# Altium schematic sheet PAGE2 - MCU.SchDoc: Koruza move driver
size A4; DrawnBy: Matej Gomboc; DocumentNumber: 2; Revision: 1.0; SheetNumber: 2; SheetTotal: 4
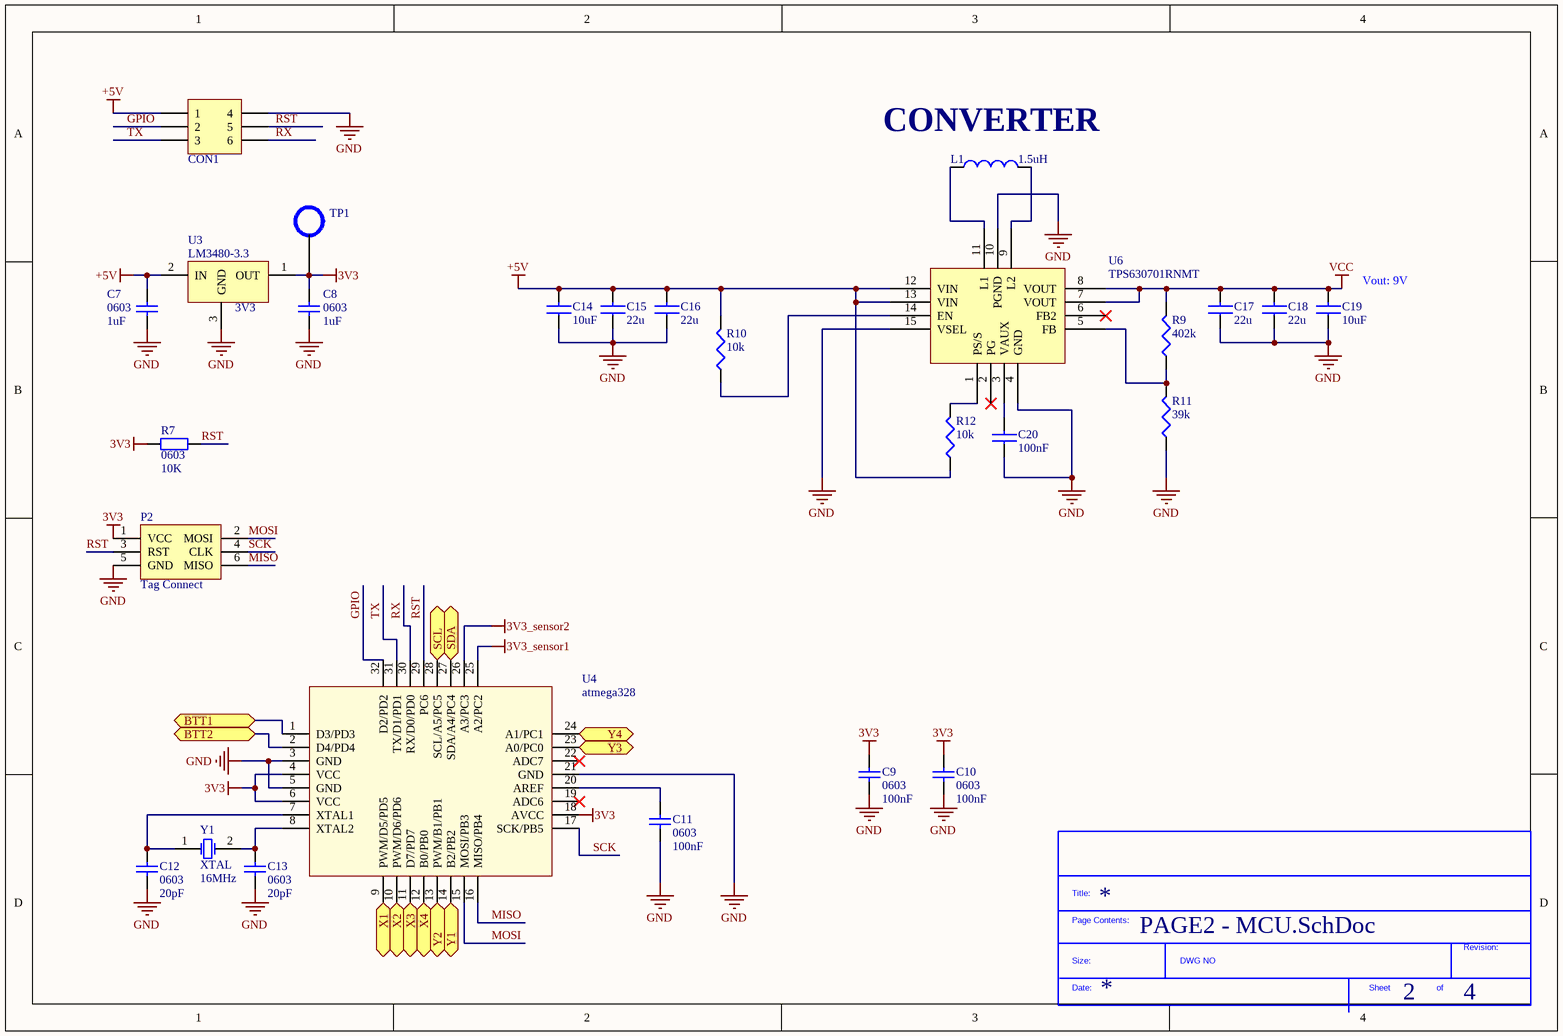
[diagram p0: PAGE2 - MCU.SchDoc]

## Parts
*?  SDTitleBlock  (value not drawn)  (graphical)
C7  0603  value 1uF  [0603_HandSoldering]
C8  0603  value 1uF  [0603_HandSoldering]
C9  0603  value 100nF  [0603_HandSoldering]
C10  0603  value 100nF  [0603_HandSoldering]
C11  0603  value 100nF  [0603_HandSoldering]
C12  0603  value 20pF  [0603_HandSoldering]
C13  0603  value 20pF  [0603_HandSoldering]
C14  10uF  [CAP0805]
C15  22u  [CAP0805]
C16  22u  [CAP0805]
C17  22u  [CAP0805]
C18  22u  [CAP0805]
C19  10uF  [CAP0805]
C20  100nF  [CAP0603]
CON1  MICROMATCH 6 SMD  [MICROMATCH2X3]  (value not drawn)
L1  1.5uH  [FDSD0402]
P2  Tag Connect  [Tag Connect]
R7  0603  value 10K  [0603_HandSoldering]
R9  402k  [RES0603]
R10  10k  [RES0603]
R11  39k  [RES0603]
R12  10k  [RES0603]
TP1  TEST_POINT  [TEST_POINT]  (value not drawn)  (no BOM)
U3  LM3480-3.3  value 3V3  [LM3480_SOT23-3]
U4  atmega328  [ATMEGA328_TQFP32]
U6  TPS630701RNMT  [VQFN TPS]
Y1  XTAL  value 16MHz  [XTAL_small]

## Ports
BTT1, BTT2, SCL, SDA, X1, X2, X3, X4, Y1, Y2, Y3, Y4

## Nets
3V3: C8.2 C9.2 C10.2 P2.1(VCC) R7.1 TP1.1(TP) U3.1(OUT) U4.4(VCC) U4.6(VCC) U4.18(AVCC)
3V3_sensor1: U4.25(A2/PC2)
3V3_sensor2: U4.26(A3/PC3)
+5V: C7.2 C14.2 C15.2 C16.2 CON1.1 R10.2 R12.1 U3.2(IN) U6.12(VIN) U6.13(VIN)
GND: C7.1 C8.1 C9.1 C10.1 C11.1 C12.1 C13.1 C14.1 C15.1 C16.1 C17.1 C18.1 C19.1 C20.1 CON1.4 P2.5(GND) R11.1 U3.3(GND) U4.3(GND) U4.5(GND) U4.21(GND) U6.4(GND) U6.10(PGND) U6.15(VSEL)
VCC: C17.2 C18.2 C19.2 R9.2 U6.7(VOUT) U6.8(VOUT)
BTT1: U4.1(D3/PD3) ; port BTT1
BTT2: U4.2(D4/PD4) ; port BTT2
GPIO: CON1.2 U4.32(D2/PD2)
MISO: P2.6(MISO) U4.16(MISO/PB4)
MOSI: P2.2(MOSI) U4.15(MOSI/PB3)
RST: CON1.5 P2.3(RST) R7.2 U4.29(PC6)
RX: CON1.6 U4.30(RX/D0/PD0)
SCK: P2.4(CLK) U4.17(SCK/PB5)
SCL: U4.28(SCL/A5/PC5) ; port SCL
SDA: U4.27(SDA/A4/PC4) ; port SDA
TX: CON1.3 U4.31(TX/D1/PD1)
X1: U4.9(PWM/D5/PD5) ; port X1
X2: U4.10(PWM/D6/PD6) ; port X2
X3: U4.11(D7/PD7) ; port X3
X4: U4.12(B0/PB0) ; port X4
Y1: U4.14(B2/PB2) ; port Y1
Y2: U4.13(PWM/B1/PB1) ; port Y2
Y3: U4.23(A0/PC0) ; port Y3
Y4: U4.24(A1/PC1) ; port Y4
NetC11_2: C11.2 U4.20(AREF)
NetC12_2: C12.2 U4.7(XTAL1) Y1.1(OSC1)
NetC13_2: C13.2 U4.8(XTAL2) Y1.2(OSC2)
NetC20_2: C20.2 U6.3(VAUX)
NetL1_1: L1.1 U6.11(L1)
NetL1_2: L1.2 U6.9(L2)
NetR9_1: R9.1 R11.2 U6.5(FB)
NetR10_1: R10.1 U6.14(EN)
NetR12_2: R12.2 U6.1(PS/S)

Not connected (* = marked no-connect by the designer): U4 19(ADC6)* 22(ADC7)*; U6 2(PG)* 6(FB2)*

## Notes on the sheet
- (near L1) CONVERTER
- (near C19) Vout: 9V
- (in symbol SDTitleBlock) Title:; Page Contents:; Revision:; Size:; DWG NO; Date:; Sheet; of

## Library data of the parts
C7-C13 = capacitor_ceramic: Ceramic Capacitor
C14 C19 = 10uF /16V: TDK - CGA4J1X5R1C106K125AC - CAP, MLCC, X5R, 10UF, 16V, 0805; Supplier 1: Farnell; Manufacturer: TDK; Manufacturer Part Number: CGA4J1X5R1C106K125AC; RoHS: YES; Stock 1: 8974; Pricing 1: 5=0.41, 50=0.146, 250=0.131, 500=0.12, 1000=0.103 (GBP); ComponentLink1URL: http://bcove.me/e1v54mtm; ComponentLink1Description: http://bcove.me/e1v54mtm; ComponentLink2URL: http://www.farnell.com/datasheets/1936565.pdf; ComponentLink2Description: http://www.farnell.com/datasheets/1936565.pdf; ComponentLink3URL: http://www.farnell.com/datasheets/1683658.pdf; ComponentLink3Description: http://www.farnell.com/datasheets/1683658.pdf; Supplier Part Number 1: 2210948RL
C15-C18 = 22u 6.3V 0805: MULTICOMP - MC0805X226M6R3CT - CAP, MLCC, X5R, 22UF, 0805; Ceramic Capacitor Case: 0805 [2012 Metric]; Capacitance: 22; Voltage Rating: 6.3; Capacitance Tolerance: ± 20%; Dielectric Characteristic: X5; Product Range: MC Series; SVHC: No SVHC (07-Jul-2017); Capacitor Terminals: SMD; Supplier 1: Farnell; Manufacturer: MULTICOMP; Manufacturer Part Number: MC0805X226M6R3CT; RoHS: YES; Stock 1: 74736; Pricing 1: 5=0.128, 50=0.0738, 250=0.0507, 500=0.042, 1500=0.0358 (GBP); Packaging: Cut Tape; Operating Temperature Min: -55; Operating Temperature Max: 85; Automotive Qualification Standard: -; MSL: -; Capacitance Tolerance ±: ± 20%; Operating Temperature Range: -55°C to +85°C<!--FANDB--><div class="features-and-benefits-container"><div class="features-and-benefits-desc-container"><span class="features-and-benefits-container-desc">SMD Multilayer Ceramic Capacitor, 0805 [2012 Metric], 22 µF, 6.3 V, ± 20%, X5R, MC Series</span></div><div class="features-and-benefits-description"><span class="features-benefits-value">The Multicomp MC series is general purpose MLCC capacitors with X5R dielectric material which provides high electrical precision, stability and reliability. This MLCC capacitor consists of a conducting material and electrodes with high density and high efficiency ceramic condensers.</span></div><div class="features-and-benefits-list"><ul class="features-and-benefits-list-list"><li class="features-and-benefits-list-item">Small size with higher capacitance values</li><li class="features-and-benefits-list-item">0201, 0402, 0603, 0805, 1206, 1210, 1812 case sizes available</li><li class="features-and-benefits-list-item">Capacitance value ranging from 100pF to 220?F</li><li class="features-and-benefits-list-item">Capacitor with lead free termination (pure Tin)</li><li class="features-and-benefits-list-item">High electrical precision, stability and reliability</li><li class="features-and-benefits-list-item">Rated voltage of 4V, 6.3V, 10V, 16V, 25V, 50V</li><li class="features-and-benefits-list-item">Operating temperature of -55°C to +85°C</li><li class="features-and-benefits-list-item">Available in ±10% and ±20; ComponentLink1URL: http://www.farnell.com/datasheets/1901289.pdf; ComponentLink1Description: http://www.farnell.com/datasheets/1901289.pdf; ComponentLink2URL: http://www.farnell.com/datasheets/1932399.pdf; ComponentLink2Description: http://www.farnell.com/datasheets/1932399.pdf; Supplier Part Number 1: 1759415
C20 = 100nF: MURATA - GRM188R71C104KA01J - CAP, MLCC, X7R, 0.1UF, 16V, 0603; Ceramic Capacitor Case: 0603 [1608 Metric]; Capacitance: 0.1; Voltage Rating: 16; Capacitance Tolerance: ± 10%; Dielectric Characteristic: X7; Product Range: GRM Series; SVHC: No SVHC (20-Jun-2016; Supplier 1: Farnell; Manufacturer: MURATA; Manufacturer Part Number: GRM188R71C104KA01J; RoHS: YES; Stock 1: 18297; Pricing 1: 10=0.0145, 100=0.0126, 500=0.0081, 2500=0.0059, 5000=0.0052, 10000=0.0046, 50000=0.0036, 100000=0.0035 (GBP); Packaging: Cut Tape; Operating Temperature Min: -55; Operating Temperature Max: 125; Automotive Qualification Standard: -; MSL: MSL 1 - Unlimited; ComponentLink1URL: http://www.farnell.com/datasheets/2189124.pdf; ComponentLink1Description: http://www.farnell.com/datasheets/2189124.pdf; Supplier Part Number 1: 2688519
CON1 = 188275-6: AMP - TE CONNECTIVITY - 188275-6 - CONNECTOR, RCPT, 6POS, 2ROW, 1.27MM; Supplier 1: Farnell; Manufacturer: AMP - TE CONNECTIVITY; Manufacturer Part Number: 188275-6; RoHS: YES; Stock 1: 82; Pricing 1: 10=0.616, 50=0.561, 100=0.517, 250=0.482, 500=0.448, 1000=0.395 (GBP); ComponentLink1URL: http://www.farnell.com/cad/1942471.pdf; ComponentLink1Description: http://www.farnell.com/cad/1942471.pdf; Supplier Part Number 1: 2452479
L1 = 1.5uH 5.1A: MURATA - FDSD0420-H-1R5M=P3 - INDUCTOR, SHIELDED, 1.5UH, 5.1A, 20%; Product Range: FDSD0420 Series; Inductance: 1.5; RMS Current (Irms): 5.1; Saturation Current (Isat): 7.7; DC Resistance Max: 0.036; Power Inductor Case: 4.2mm x 4.2mm x 2; SVHC: No SVHC (17-Dec-2015); Supplier 1: Farnell; Manufacturer: MURATA; Manufacturer Part Number: FDSD0420-H-1R5M=P3; RoHS: YES; Stock 1: 1471; Pricing 1: 5=0.79, 50=0.448, 250=0.422, 500=0.377, 1000=0.305, 2000=0.298, 10000=0.291, 20000=0.284 (GBP); Inductor Construction: Shielded; Inductance Tolerance: ± 20%; Packaging: Each; MSL: MSL 1 - Unlimited<!--FANDB--><div class="features-and-benefits-container"></div>; ComponentLink1URL: http://www.farnell.com/datasheets/2021980.pdf; ComponentLink1Description: http://www.farnell.com/datasheets/2021980.pdf; Supplier Part Number 1: 2530091
P2 = Tag Connect: TC2030-CTX-NL
R7 = resistor
R9 = 402k: MULTICOMP - MC0063W06031402K - RES, THICK FILM, 402K, 1%, 0.063W, 0603; Resistance: 402; Voltage Rating: 50; Resistor Case Style: 0603 [1608 Metric]; Power Rating: 63; Product Range: MC Series; Temperature Coefficient: ± 100; SVHC: No SVHC (12-Jan-2017); Reel Quantity: 5000; Resistor Mounting: Surface Mount Device<!--FANDB--><div class="features-and-benefits-container"><div class="features-and-benefits-desc-container"><span class="features-and-benefits-container-desc">SMD Chip Resistor, Thick Film, 402 kohm, 50 V, 0603 [1608 Metric], 63 mW, ± 1%, MC Series</span></div><div class="features-and-benefits-description"><span class="features-benefits-value">The Multicomp MC series current sense resistors are thick film chip resistors. The resistance range includes E96 and E24 decade values from 1ohm to 10Mohm.</span></div><div class="features-and-benefits-list"><ul class="features-and-benefits-list-list"><li class="features-and-benefits-list-item">EIA 0402, 0603, 0805, 1206 chip sizes available</li><li class="features-and-benefits-list-item">Small size and low weight</li><li class="features-and-benefits-list-item">Suitable for both wave and reflow soldering</li><li class="features-and-benefits-list-item">Reduction of assembly costs</li><li class="features-and-benefits-list-item">Maximum working voltage of 50V(0402, 0603), 150V(0805), 200V(1206)</li><li class="features-and-benefits-list-item">Available in ±1%, ±2% and ±5% tolerance</li><li class="features-and-benefits-list-item">Power rating of 62.5mW, 100mW and 125mW</li><li class="features-and-benefits-list-item">±400ppm/°C(1ohm to 10ohm), ±200ppm/°C(11ohm to 100ohm), ±100; Supplier 1: Farnell; Manufacturer: MULTICOMP; Manufacturer Part Number: MC0063W06031402K; RoHS: Y-EX; Stock 1: 104996; Pricing 1: 5000=0.0007, 25000=0.0006, 50000=0.0005 (GBP); Resistance Tolerance: ± 1%; Packaging: Tape & Reel; Resistor Element Material: Thick Film; Automotive Qualification Standard: -; ComponentLink1URL: http://www.farnell.com/datasheets/1788326.pdf; ComponentLink1Description: http://www.farnell.com/datasheets/1788326.pdf; ComponentLink2URL: http://www.farnell.com/datasheets/1944283.pdf; ComponentLink2Description: http://www.farnell.com/datasheets/1944283.pdf; Supplier Part Number 1: 2131065
R10 R12 = 10k: MULTICOMP - MCMR06X103 JTL - RES, CERAMIC, 10K, 5%, 0.1W, 0603; Resistance: 10; Voltage Rating: 75; Resistor Case Style: 0603 [1608 Metric]; Power Rating: 100; Product Range: MCMR Series; Temperature Coefficient: ± 100; Automotive Qualification Standard: -<!--FANDB--><div class="features-and-benefits-container"><div class="features-and-benefits-description"><span class="features-benefits-value">The Multicomp MCMR series resistors are automotive grade, anti sulphured thick film chip resistor. The resistance range includes E24 and E96 decade values from 1ohm to 10Mohm. These resistors are constructed on top of a high grade ceramic body.</span></div><div class="features-and-benefits-list"><ul class="features-and-benefits-list-list"><li class="features-and-benefits-list-item">EIA 0402, 0603, 0805, 1206 chip sizes available</li><li class="features-and-benefits-list-item">High reliability and stability</li><li class="features-and-benefits-list-item">Automotive grade AEC-Q200 compliant</li><li class="features-and-benefits-list-item">Complaint with (IEC 60068-1) 55/155/56 climatic category</li><li class="features-and-benefits-list-item">Maximum operation voltage of 50V, 75V, 150V and 200V</li><li class="features-and-benefits-list-item">Power rating of 62.5mW, 100mW, 125mW and 250mW</li><li class="features-and-benefits-list-item">Available in ±1% and ±5% tolerance</li><li class="features-and-benefits-list-item">Temperature coefficient (TCR) of +200ppm/°C, +100ppm/°C and -200ppm/°C to +400ppm/°C</li><li class="features-and-benefits-list-item">Operating temperature range -55°C to 155; Supplier 1: Farnell; Manufacturer: MULTICOMP; Manufacturer Part Number: MCMR06X103 JTL; RoHS: Y-EX; Stock 1: 19791; Pricing 1: 10=0.0087, 100=0.0074, 500=0.0061, 1000=0.0048, 2500=0.0032, 5000=0.0024, 25000=0.0016, 50000=0.0013 (GBP); Resistance Tolerance: ± 5%; Packaging: Cut Tape; Resistor Element Material: Ceramic; ComponentLink1URL: http://www.farnell.com/datasheets/1716707.pdf; ComponentLink1Description: http://www.farnell.com/datasheets/1716707.pdf; Supplier Part Number 1: 2073356
R11 = 39k: VISHAY - CRCW060339K0FKEAHP - RES, THICK FILM, 39K, 1%, 0.25W, 0603; Resistance: 39; Voltage Rating: 75; Resistor Case Style: 0603 [1608 Metric]; Power Rating: 250; Product Range: CRCW-HP Series; Temperature Coefficient: ± 100; Automotive Qualification Standard: AEC-Q200; External Depth: 0.85; External Length / Height: 0.45; External Width: 1.6; No. of Pins: 2; Reel Quantity: 5000; Resistor Mounting: Surface Mount Device<!--FANDB--><div class="features-and-benefits-container"><div class="features-and-benefits-desc-container"><span class="features-and-benefits-container-desc">SMD Chip Resistor, Thick Film, 39 kohm, 75 V, 0603 [1608 Metric], 250 mW, ± 1%, CRCW-HP Series</span></div><div class="features-and-benefits-description"><span class="features-benefits-value">The Vishay CRCW-HP e3 series are pulse proof, high power thick film chip resistors. The CRCW-HP e3 series resistors have pure tin solder contacts on the Ni barrier layer that provides compatibility with the reflow soldering process</span></div><div class="features-and-benefits-list"><ul class="features-and-benefits-list-list"><li class="features-and-benefits-list-item">Excellent pulse load capability</li><li class="features-and-benefits-list-item">Enhanced power rating</li><li class="features-and-benefits-list-item">Double side printed resistor element</li><li class="features-and-benefits-list-item">Protective overglaze</li><li class="features-and-benefits-list-item">AEC-Q200 qualified, rev. C compliant</li><li class="features-and-benefits-list-item">Available in ±0.5%, ±1% and ± 5% tolerance</li><li class="features-and-benefits-list-item">Zero ohm jumper are available for all sizes with very high current</li><li class="features-and-benefits-list-item">Power rating is double than the D/CRCW e3 series</li><li class="features-and-benefits-list-item">Superior antisurge and pulse characteristics compared to D/CRCW e3 series</li></ul></div><div class="features-and-benefits-applications"><ul class="features-and-benefits-value"><li class="features-and-benefits-list-item">Automotive</li><li class="features-and-benefits-list-item">Industrial</li><li class="features-and-benefits-list-item">Power Management</li><li class="features-and-benefits-list-item">Consumer Electronics</li><li class="features-and-benefits-list-item">Portable Devices</li></ul></div></div>; Supplier 1: Farnell; Manufacturer: VISHAY; Manufacturer Part Number: CRCW060339K0FKEAHP; RoHS: Y-EX; Stock 1: 10263; Pricing 1: 10=0.14, 100=0.0704, 500=0.0459, 1000=0.0344, 2500=0.0276, 5000=0.0156, 25000=0.0148, 50000=0.0147 (GBP); Resistance Tolerance: ± 1%; Packaging: Cut Tape; Resistor Element Material: Thick Film; MSL: MSL 1 - Unlimited; Operating Temperature Max: 155; Operating Temperature Min: -55; Operating Temperature Range: -55°C to +155; ComponentLink1URL: http://www.farnell.com/datasheets/2339608.pdf; ComponentLink1Description: http://www.farnell.com/datasheets/2339608.pdf; Supplier Part Number 1: 1738925
TP1 = TEST_POINT: Test point
U3 = LM3480: LM3480-3.3 3.3V LDO regulator
U4 = atmega328: 32 TQFP atmega328
U6 = TPS630701RNMT: TEXAS INSTRUMENTS - TPS630701RNMT - DC/DC CONV, BUCK-BOOST, 2.4MHZ, VQFN-15; Input Voltage Min: 2; Input Voltage Max: 16; DC / DC Converter IC Case: VQFN; No. of Pins: 15; Output Voltage Nom.: 5; Switching Frequency: 2.4; SVHC: No SVHC (17-Dec-2015; Supplier 1: Farnell; Manufacturer: TEXAS INSTRUMENTS; Manufacturer Part Number: TPS630701RNMT; RoHS: YES; Stock 1: 456; Pricing 1: 1=2.23, 10=1.87, 100=1.7, 250=1.56, 500=1.47, 1000=1.21 (GBP); Topology: Buck-Boost; Output Current: 2; Operating Temperature Max: 125; Packaging: Cut Tape; Product Range: -; Automotive Qualification Standard: -; MSL: MSL 1 - Unlimited; ComponentLink1URL: http://www.ti.com/general/docs/lit/getliterature.tsp?genericPartNumber=TPS63070&fileType=pdf; ComponentLink1Description: http://www.ti.com/general/docs/lit/getliterature.tsp?genericPartNumber=TPS63070&fileType=pdf; Supplier Part Number 1: 2643432
Y1 = XTAL: Crystal Oscillator